# EAGLE design coil-control-rev (EAGLE 9.6.2)
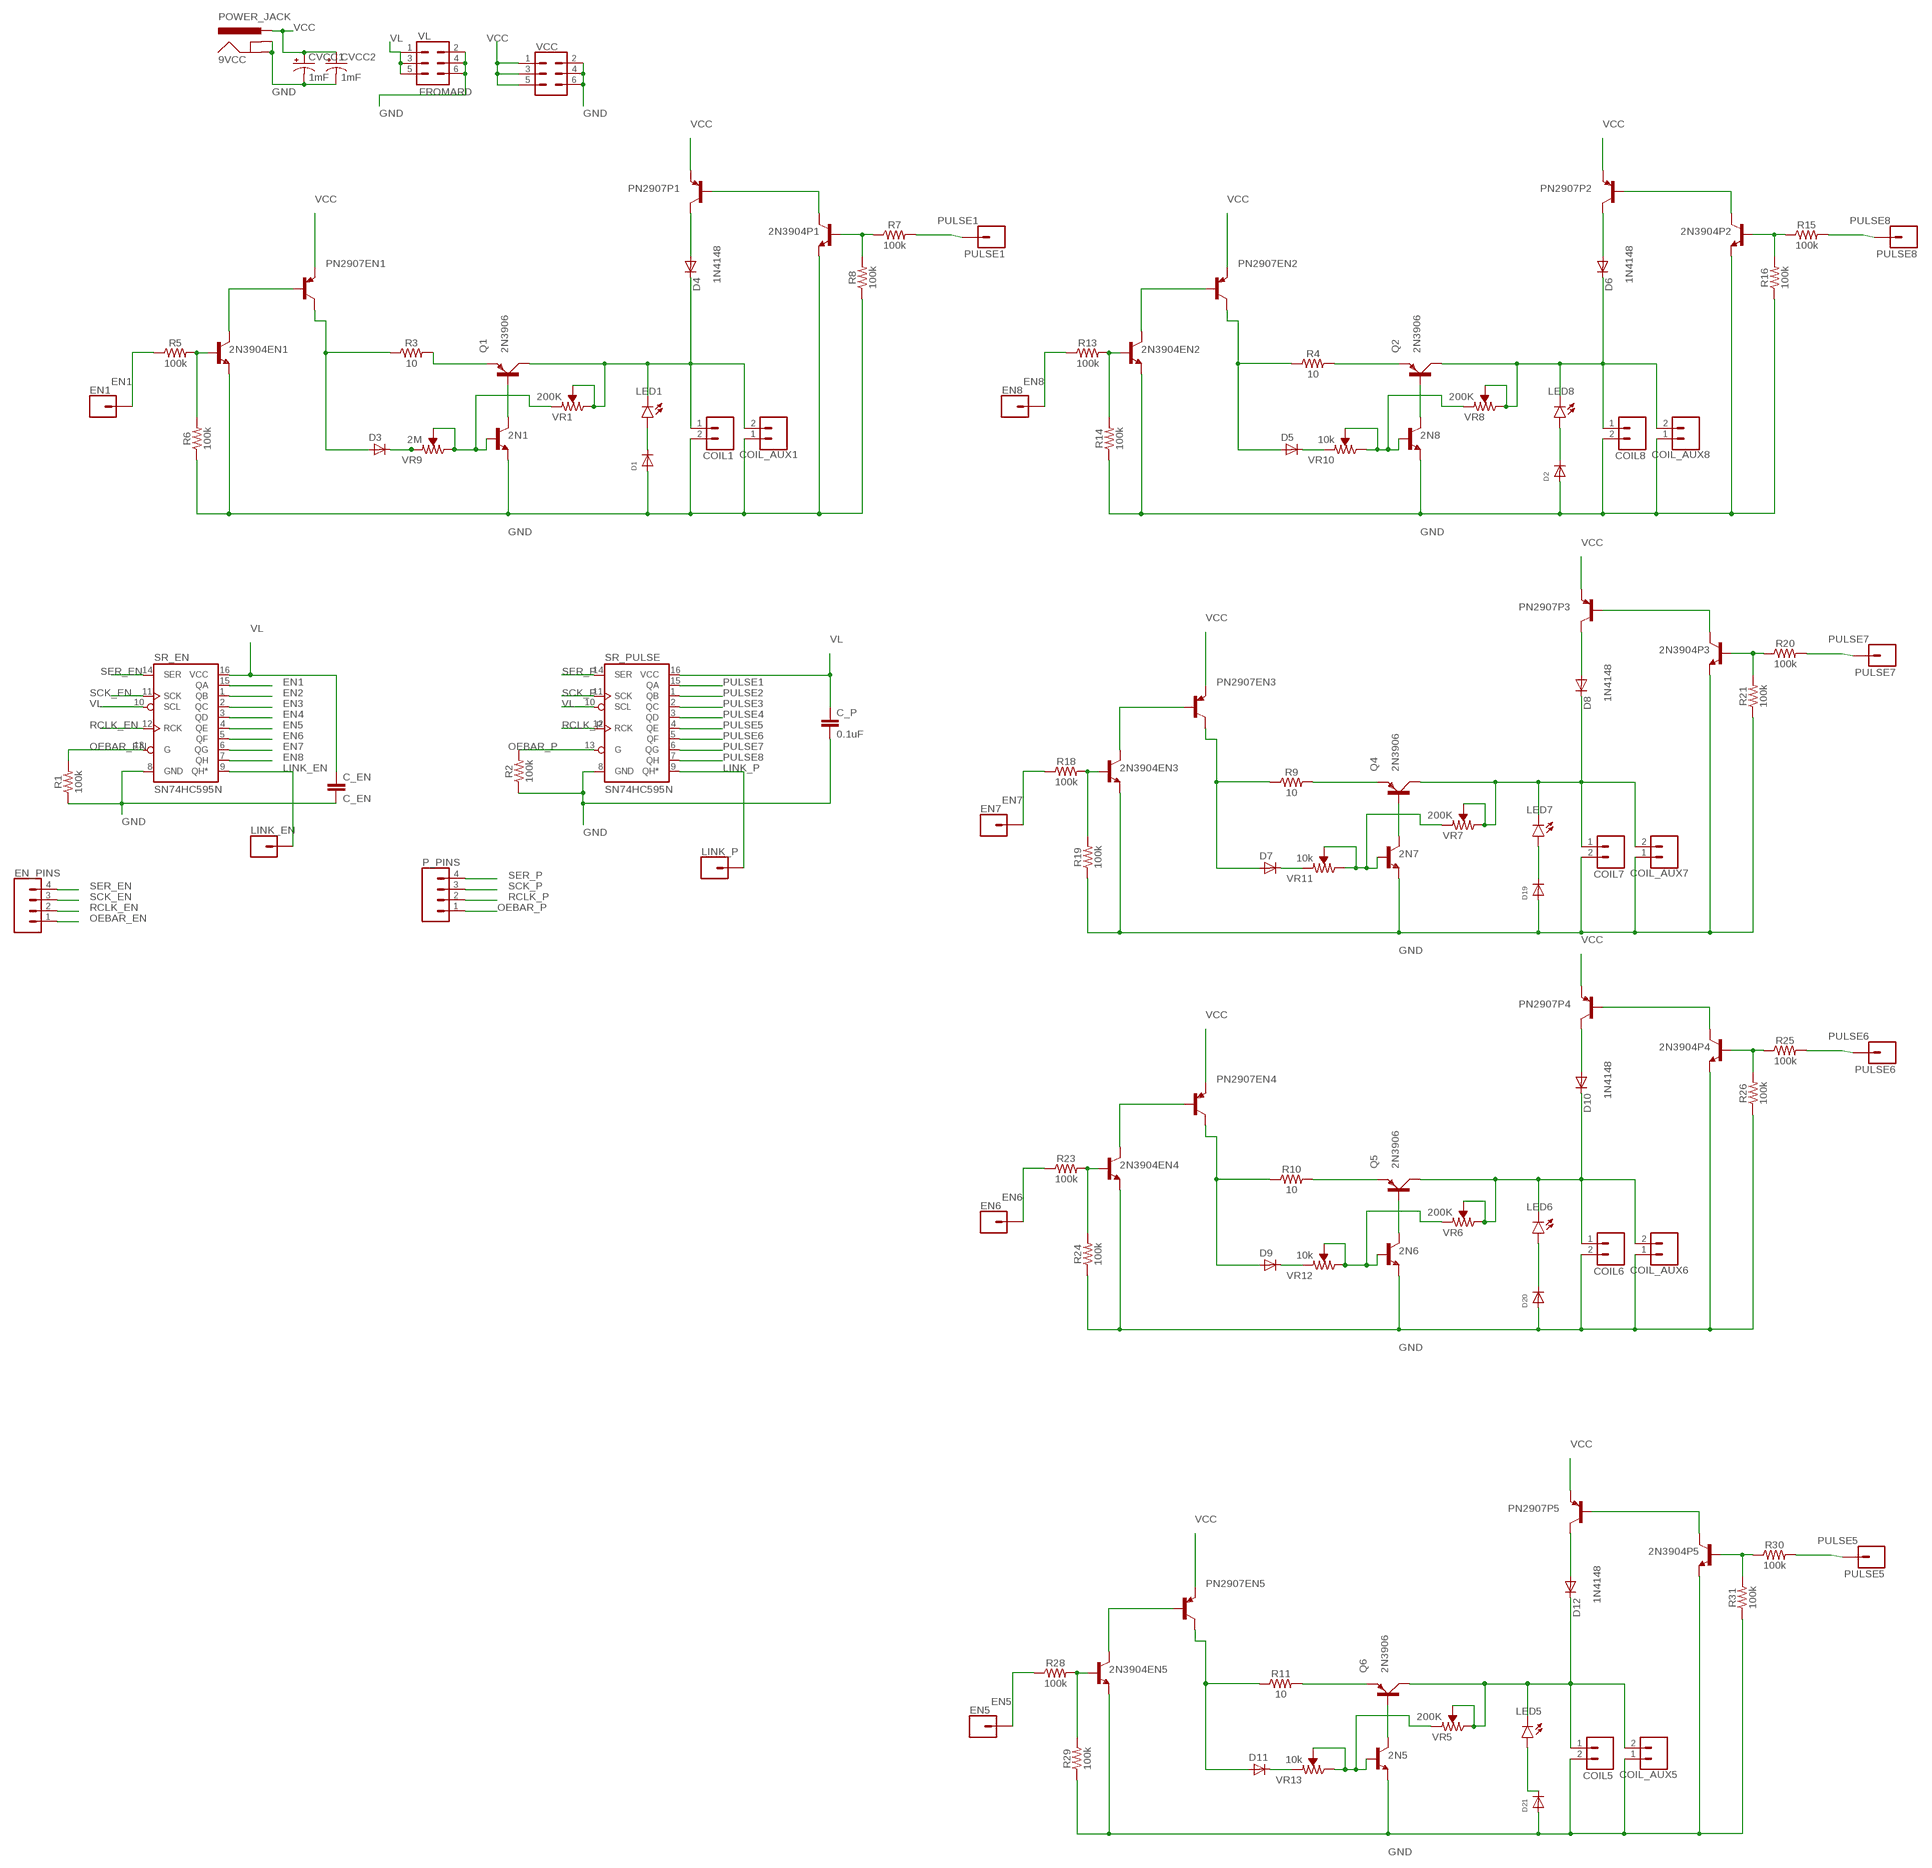
[diagram p0: schematic, sheet 1, part 1 of 2]
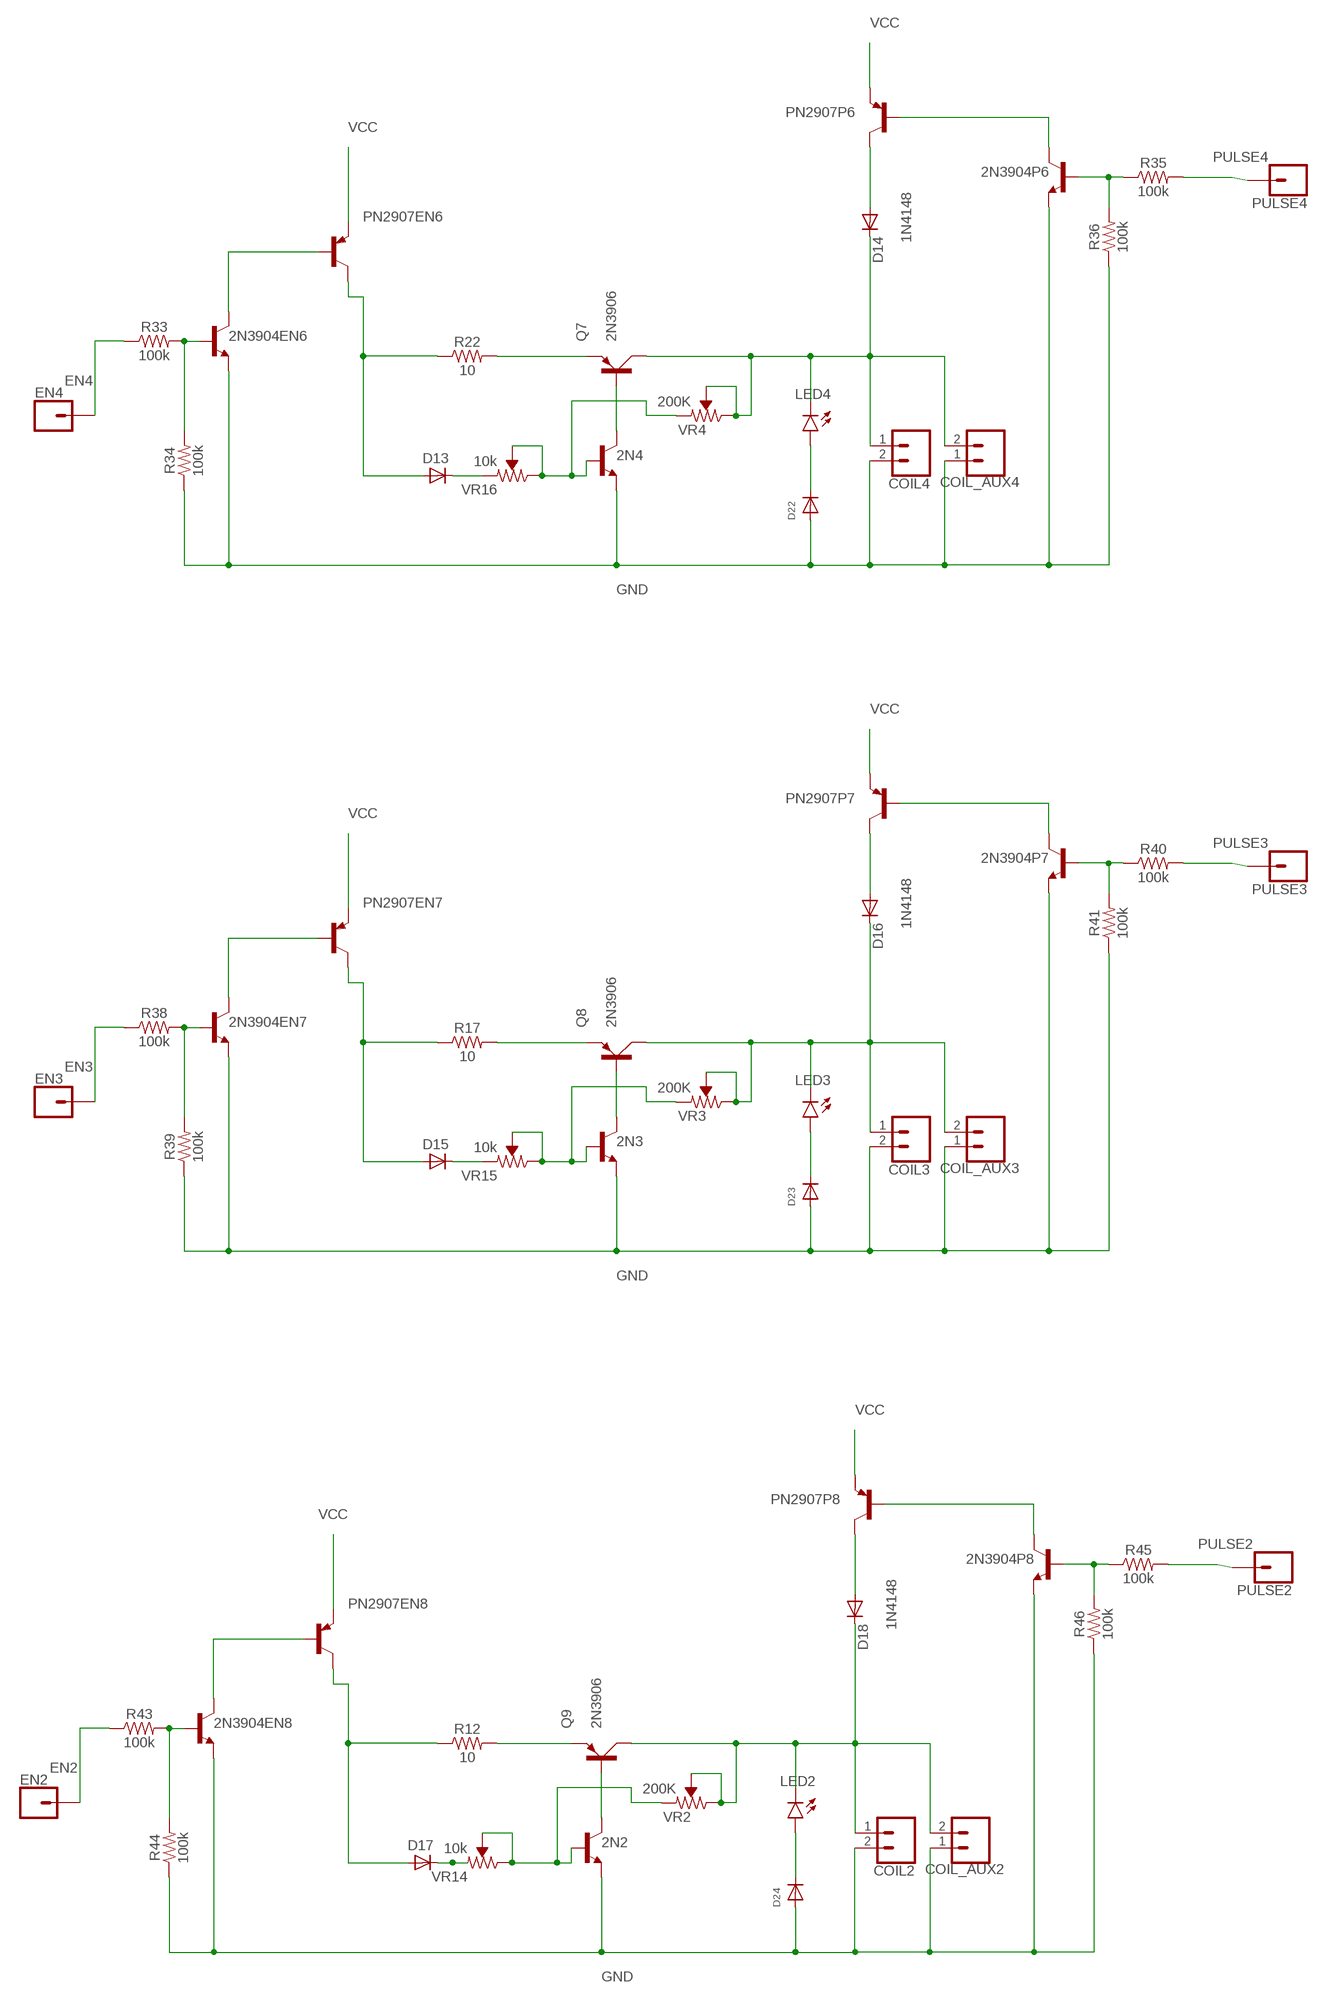
[diagram p1: schematic, sheet 1, part 2 of 2]

## Parts
2N1  2N2222  [TO92-EBC-OVAL]
2N2  2N2222  [TO92-EBC-OVAL]
2N3  2N2222  [TO92-EBC-OVAL]
2N4  2N2222  [TO92-EBC-OVAL]
2N5  2N2222  [TO92-EBC-OVAL]
2N6  2N2222  [TO92-EBC-OVAL]
2N7  2N2222  [TO92-EBC-OVAL]
2N8  2N2222  [TO92-EBC-OVAL]
2N3904EN1  2N3904  [TO92]
2N3904EN2  2N3904  [TO92]
2N3904EN3  2N3904  [TO92]
2N3904EN4  2N3904  [TO92]
2N3904EN5  2N3904  [TO92]
2N3904EN6  2N3904  [TO92]
2N3904EN7  2N3904  [TO92]
2N3904EN8  2N3904  [TO92]
2N3904P1  2N3904  [TO92]
2N3904P2  2N3904  [TO92]
2N3904P3  2N3904  [TO92]
2N3904P4  2N3904  [TO92]
2N3904P5  2N3904  [TO92]
2N3904P6  2N3904  [TO92]
2N3904P7  2N3904  [TO92]
2N3904P8  2N3904  [TO92]
9VCC  POWER_JACK  [POWER_JACK_PTH]
C_EN  C_EN  0.1UF-KIT-EZ-50V-20%  [CAP-PTH-SMALL-KIT]
C_P  0.1uF  0.1UF-KIT-EZ-50V-20%  [CAP-PTH-SMALL-KIT]
COIL1  CONN_02  [1X02]
COIL2  CONN_02  [1X02]
COIL3  CONN_02  [1X02]
COIL4  CONN_02  [1X02]
COIL5  CONN_02  [1X02]
COIL6  CONN_02  [1X02]
COIL7  CONN_02  [1X02]
COIL8  CONN_02  [1X02]
COIL_AUX1  CONN_02  [1X02]
COIL_AUX2  CONN_02  [1X02]
COIL_AUX3  CONN_02  [1X02]
COIL_AUX4  CONN_02  [1X02]
COIL_AUX5  CONN_02  [1X02]
COIL_AUX6  CONN_02  [1X02]
COIL_AUX7  CONN_02  [1X02]
COIL_AUX8  CONN_02  [1X02]
CVCC1  1mF  1000UF-RADIAL-5MM-25V-20%  [CPOL-RADIAL-5MM-10MM]
CVCC2  1mF  1000UF-RADIAL-5MM-25V-20%  [CPOL-RADIAL-5MM-10MM]
D1  DIODEDO-1N4148  [DO-1N4148]
D2  DIODEDO-1N4148  [DO-1N4148]
D3  DIODEDO-1N4148  [DO-1N4148]
D4  1N4148  DIODEDO-1N4148  [DO-1N4148]
D5  DIODEDO-1N4148  [DO-1N4148]
D6  1N4148  DIODEDO-1N4148  [DO-1N4148]
D7  DIODEDO-1N4148  [DO-1N4148]
D8  1N4148  DIODEDO-1N4148  [DO-1N4148]
D9  DIODEDO-1N4148  [DO-1N4148]
D10  1N4148  DIODEDO-1N4148  [DO-1N4148]
D11  200mA/100V/1V  DIODEDO-1N4148  [DO-1N4148]
D12  1N4148  DIODEDO-1N4148  [DO-1N4148]
D13  DIODEDO-1N4148  [DO-1N4148]
D14  1N4148  DIODEDO-1N4148  [DO-1N4148]
D15  DIODEDO-1N4148  [DO-1N4148]
D16  1N4148  DIODEDO-1N4148  [DO-1N4148]
D17  DIODEDO-1N4148  [DO-1N4148]
D18  1N4148  DIODEDO-1N4148  [DO-1N4148]
D19  DIODEDO-1N4148  [DO-1N4148]
D20  DIODEDO-1N4148  [DO-1N4148]
D21  DIODEDO-1N4148  [DO-1N4148]
D22  DIODEDO-1N4148  [DO-1N4148]
D23  DIODEDO-1N4148  [DO-1N4148]
D24  DIODEDO-1N4148  [DO-1N4148]
EN1  CONN_01  [1X01]
EN2  CONN_01  [1X01]
EN3  CONN_01  [1X01]
EN4  CONN_01  [1X01]
EN5  CONN_01  [1X01]
EN6  CONN_01  [1X01]
EN7  CONN_01  [1X01]
EN8  EN2  CONN_01  [1X01]
EN_PINS  CONN_04PTH  [1X04]
LED1  LED3MM  [LED_3MM]
LED2  LED3MM  [LED_3MM]
LED3  LED3MM  [LED_3MM]
LED4  LED3MM  [LED_3MM]
LED5  LED3MM  [LED_3MM]
LED6  LED3MM  [LED_3MM]
LED7  LED3MM  [LED_3MM]
LED8  LED3MM  [LED_3MM]
LINK_EN  CONN_01  [1X01]
LINK_P  CONN_01  [1X01]
P_PINS  CONN_04PTH  [1X04]
PN2907EN1  2N2907  [TO92-EBC-OVAL]
PN2907EN2  2N2907  [TO92-EBC-OVAL]
PN2907EN3  2N2907  [TO92-EBC-OVAL]
PN2907EN4  2N2907  [TO92-EBC-OVAL]
PN2907EN5  2N2907  [TO92-EBC-OVAL]
PN2907EN6  2N2907  [TO92-EBC-OVAL]
PN2907EN7  2N2907  [TO92-EBC-OVAL]
PN2907EN8  2N2907  [TO92-EBC-OVAL]
PN2907P1  2N2907  [TO92-EBC-OVAL]
PN2907P2  2N2907  [TO92-EBC-OVAL]
PN2907P3  2N2907  [TO92-EBC-OVAL]
PN2907P4  2N2907  [TO92-EBC-OVAL]
PN2907P5  2N2907  [TO92-EBC-OVAL]
PN2907P6  2N2907  [TO92-EBC-OVAL]
PN2907P7  2N2907  [TO92-EBC-OVAL]
PN2907P8  2N2907  [TO92-EBC-OVAL]
PULSE1  CONN_01  [1X01]
PULSE2  CONN_01  [1X01]
PULSE3  CONN_01  [1X01]
PULSE4  CONN_01  [1X01]
PULSE5  CONN_01  [1X01]
PULSE6  CONN_01  [1X01]
PULSE7  PULSE3  CONN_01  [1X01]
PULSE8  PULSE2  CONN_01  [1X01]
Q1  2N3906  [TO92D]
Q2  2N3906  [TO92D]
Q4  2N3906  [TO92D]
Q5  2N3906  [TO92D]
Q6  2N3906  [TO92D]
Q7  2N3906  [TO92D]
Q8  2N3906  [TO92D]
Q9  2N3906  [TO92D]
R1  100k  100KOHM-HORIZ-1/4W-1%  [AXIAL-0.3]
R2  100k  100KOHM-HORIZ-1/4W-1%  [AXIAL-0.3]
R3  10  10OHM-VERT-1/4W-1%  [AXIAL-0.1]
R4  10  10OHM-VERT-1/4W-1%  [AXIAL-0.1]
R5  100k  100KOHM-HORIZ-1/4W-1%  [AXIAL-0.3]
R6  100k  100KOHM-HORIZ-1/4W-1%  [AXIAL-0.3]
R7  100k  100KOHM-HORIZ-1/4W-1%  [AXIAL-0.3]
R8  100k  100KOHM-HORIZ-1/4W-1%  [AXIAL-0.3]
R9  10  10OHM-VERT-1/4W-1%  [AXIAL-0.1]
R10  10  10OHM-VERT-1/4W-1%  [AXIAL-0.1]
R11  10  10OHM-VERT-1/4W-1%  [AXIAL-0.1]
R12  10  10OHM-VERT-1/4W-1%  [AXIAL-0.1]
R13  100k  100KOHM-HORIZ-1/4W-1%  [AXIAL-0.3]
R14  100k  100KOHM-HORIZ-1/4W-1%  [AXIAL-0.3]
R15  100k  100KOHM-HORIZ-1/4W-1%  [AXIAL-0.3]
R16  100k  100KOHM-HORIZ-1/4W-1%  [AXIAL-0.3]
R17  10  10OHM-VERT-1/4W-1%  [AXIAL-0.1]
R18  100k  100KOHM-HORIZ-1/4W-1%  [AXIAL-0.3]
R19  100k  100KOHM-HORIZ-1/4W-1%  [AXIAL-0.3]
R20  100k  100KOHM-HORIZ-1/4W-1%  [AXIAL-0.3]
R21  100k  100KOHM-HORIZ-1/4W-1%  [AXIAL-0.3]
R22  10  10OHM-VERT-1/4W-1%  [AXIAL-0.1]
R23  100k  100KOHM-HORIZ-1/4W-1%  [AXIAL-0.3]
R24  100k  100KOHM-HORIZ-1/4W-1%  [AXIAL-0.3]
R25  100k  100KOHM-HORIZ-1/4W-1%  [AXIAL-0.3]
R26  100k  100KOHM-HORIZ-1/4W-1%  [AXIAL-0.3]
R28  100k  100KOHM-HORIZ-1/4W-1%  [AXIAL-0.3]
R29  100k  100KOHM-HORIZ-1/4W-1%  [AXIAL-0.3]
R30  100k  100KOHM-HORIZ-1/4W-1%  [AXIAL-0.3]
R31  100k  100KOHM-HORIZ-1/4W-1%  [AXIAL-0.3]
R33  100k  100KOHM-HORIZ-1/4W-1%  [AXIAL-0.3]
R34  100k  100KOHM-HORIZ-1/4W-1%  [AXIAL-0.3]
R35  100k  100KOHM-HORIZ-1/4W-1%  [AXIAL-0.3]
R36  100k  100KOHM-HORIZ-1/4W-1%  [AXIAL-0.3]
R38  100k  100KOHM-HORIZ-1/4W-1%  [AXIAL-0.3]
R39  100k  100KOHM-HORIZ-1/4W-1%  [AXIAL-0.3]
R40  100k  100KOHM-HORIZ-1/4W-1%  [AXIAL-0.3]
R41  100k  100KOHM-HORIZ-1/4W-1%  [AXIAL-0.3]
R43  100k  100KOHM-HORIZ-1/4W-1%  [AXIAL-0.3]
R44  100k  100KOHM-HORIZ-1/4W-1%  [AXIAL-0.3]
R45  100k  100KOHM-HORIZ-1/4W-1%  [AXIAL-0.3]
R46  100k  100KOHM-HORIZ-1/4W-1%  [AXIAL-0.3]
SR_EN  SN74HC595N  74HC595N  [DIP16]
SR_PULSE  SN74HC595N  74HC595N  [DIP16]
VCC  CONN_03X2NO_SILK  [2X3-NS]
VL  FROMARD  CONN_03X2FEMALE  [2X3]
VR1  200K  TRIMPOT-PTH-10MM-KNOB-1/2W-10%  [TRIMPOT-PTH-3386U]
VR2  200K  TRIMPOT-PTH-10MM-KNOB-1/2W-10%  [TRIMPOT-PTH-3386U]
VR3  200K  TRIMPOT-PTH-10MM-KNOB-1/2W-10%  [TRIMPOT-PTH-3386U]
VR4  200K  TRIMPOT-PTH-10MM-KNOB-1/2W-10%  [TRIMPOT-PTH-3386U]
VR5  200K  TRIMPOT-PTH-10MM-KNOB-1/2W-10%  [TRIMPOT-PTH-3386U]
VR6  200K  TRIMPOT-PTH-10MM-KNOB-1/2W-10%  [TRIMPOT-PTH-3386U]
VR7  200K  TRIMPOT-PTH-10MM-KNOB-1/2W-10%  [TRIMPOT-PTH-3386U]
VR8  200K  TRIMPOT-PTH-10MM-KNOB-1/2W-10%  [TRIMPOT-PTH-3386U]
VR9  2M  TRIMPOT-PTH-10MM-KNOB-1/2W-10%  [TRIMPOT-PTH-3386U]
VR10  10k  TRIMPOT-PTH-10MM-KNOB-1/2W-10%  [TRIMPOT-PTH-3386U]
VR11  10k  TRIMPOT-PTH-10MM-KNOB-1/2W-10%  [TRIMPOT-PTH-3386U]
VR12  10k  TRIMPOT-PTH-10MM-KNOB-1/2W-10%  [TRIMPOT-PTH-3386U]
VR13  10k  TRIMPOT-PTH-10MM-KNOB-1/2W-10%  [TRIMPOT-PTH-3386U]
VR14  10k  TRIMPOT-PTH-10MM-KNOB-1/2W-10%  [TRIMPOT-PTH-3386U]
VR15  10k  TRIMPOT-PTH-10MM-KNOB-1/2W-10%  [TRIMPOT-PTH-3386U]
VR16  10k  TRIMPOT-PTH-10MM-KNOB-1/2W-10%  [TRIMPOT-PTH-3386U]

## Nets
EN1: EN1.1 R5.P$1 SR_EN.15(QA)
EN2: EN2.1 R43.P$1 SR_EN.1(QB)
EN3: EN3.1 R38.P$1 SR_EN.2(QC)
EN4: EN4.1 R33.P$1 SR_EN.3(QD)
EN5: EN5.1 R28.P$1 SR_EN.4(QE)
EN6: EN6.1 R23.P$1 SR_EN.5(QF)
EN7: EN7.1 R18.P$1 SR_EN.6(QG)
EN8: EN8.1 R13.P$1 SR_EN.7(QH)
GND: 2N1.E 2N2.E 2N3.E 2N4.E 2N5.E 2N6.E 2N7.E 2N8.E 2N3904EN1.3(E) 2N3904EN2.3(E) 2N3904EN3.3(E) 2N3904EN4.3(E) 2N3904EN5.3(E) 2N3904EN6.3(E) 2N3904EN7.3(E) 2N3904EN8.3(E) 2N3904P1.3(E) 2N3904P2.3(E) 2N3904P3.3(E) 2N3904P4.3(E) 2N3904P5.3(E) 2N3904P6.3(E) 2N3904P7.3(E) 2N3904P8.3(E) 9VCC.GND 9VCC.GNDBREAK C_EN.2 C_P.2 COIL1.2 COIL2.2 COIL3.2 COIL4.2 COIL5.2 COIL6.2 COIL7.2 COIL8.2 COIL_AUX1.1 COIL_AUX2.1 COIL_AUX3.1 COIL_AUX4.1 COIL_AUX5.1 COIL_AUX6.1 COIL_AUX7.1 COIL_AUX8.1 CVCC1.- CVCC2.- D1.A D2.A D19.A D20.A D21.A D22.A D23.A D24.A R1.P$1 R2.P$1 R6.P$1 R8.P$1 R14.P$1 R16.P$1 R19.P$1 R21.P$1 R24.P$1 R26.P$1 R29.P$1 R31.P$1 R34.P$1 R36.P$1 R39.P$1 R41.P$1 R44.P$1 R46.P$1 SR_EN.8(GND) SR_PULSE.8(GND) VCC.2 VCC.4 VCC.6 VL.2 VL.4 VL.6
LINK_EN: LINK_EN.1 SR_EN.9(QH*)
LINK_P: LINK_P.1 SR_PULSE.9(QH*)
N$1: 2N3904EN2.1(C) PN2907EN2.B
N$2: 2N3904EN3.1(C) PN2907EN3.B
N$3: 2N3904EN1.1(C) PN2907EN1.B
N$4: 2N3904EN4.1(C) PN2907EN4.B
N$5: 2N3904EN5.1(C) PN2907EN5.B
N$6: 2N3904EN8.1(C) PN2907EN8.B
N$7: 2N1.B VR1.1(CCW) VR9.2(WIPER) VR9.3(CW)
N$8: 2N3904EN7.1(C) PN2907EN7.B
N$9: D3.C VR9.1(CCW)
N$10: 2N1.C Q1.B
N$11: D4.A PN2907P1.C
N$12: D3.A PN2907EN1.C R3.P$1
N$13: 2N3904P1.2(B) R7.P$1 R8.P$2
N$14: 2N3904P1.1(C) PN2907P1.B
N$15: 2N3904EN1.2(B) R5.P$2 R6.P$2
N$16: 2N8.B VR8.1(CCW) VR10.2(WIPER) VR10.3(CW)
N$17: 2N3904EN6.1(C) PN2907EN6.B
N$18: D5.C VR10.1(CCW)
N$19: 2N8.C Q2.B
N$20: D6.A PN2907P2.C
N$21: D5.A PN2907EN2.C R4.P$1
N$22: 2N3904P2.2(B) R15.P$1 R16.P$2
N$23: 2N3904P2.1(C) PN2907P2.B
N$24: 2N3904EN2.2(B) R13.P$2 R14.P$2
N$25: D9.C VR12.1(CCW)
N$26: D7.C VR11.1(CCW)
N$27: 2N7.C Q4.B
N$28: D8.A PN2907P3.C
N$29: D7.A PN2907EN3.C R9.P$1
N$30: 2N3904P3.2(B) R20.P$1 R21.P$2
N$31: 2N3904P3.1(C) PN2907P3.B
N$32: 2N3904EN3.2(B) R18.P$2 R19.P$2
N$33: 2N6.B VR6.1(CCW) VR12.2(WIPER) VR12.3(CW)
N$34: Q1.E R3.P$2
N$35: 2N6.C Q5.B
N$36: D10.A PN2907P4.C
N$37: D9.A PN2907EN4.C R10.P$1
N$38: 2N3904P4.2(B) R25.P$1 R26.P$2
N$39: 2N3904P4.1(C) PN2907P4.B
N$40: 2N3904EN4.2(B) R23.P$2 R24.P$2
N$41: 2N5.B VR5.1(CCW) VR13.2(WIPER) VR13.3(CW)
N$42: D11.C VR13.1(CCW)
N$43: 2N5.C Q6.B
N$44: D12.A PN2907P5.C
N$45: D11.A PN2907EN5.C R11.P$1
N$46: 2N3904P5.2(B) R30.P$1 R31.P$2
N$47: 2N3904P5.1(C) PN2907P5.B
N$48: 2N3904EN5.2(B) R28.P$2 R29.P$2
N$49: Q2.E R4.P$2
N$50: D13.C VR16.1(CCW)
N$51: 2N4.C Q7.B
N$52: D14.A PN2907P6.C
N$53: D13.A PN2907EN6.C R22.P$1
N$54: 2N3904P6.2(B) R35.P$1 R36.P$2
N$55: 2N3904P6.1(C) PN2907P6.B
N$56: 2N3904EN6.2(B) R33.P$2 R34.P$2
N$57: Q4.E R9.P$2
N$58: D15.C VR15.1(CCW)
N$59: 2N3.C Q8.B
N$60: D16.A PN2907P7.C
N$61: D15.A PN2907EN7.C R17.P$1
N$62: 2N3904P7.2(B) R40.P$1 R41.P$2
N$63: 2N3904P7.1(C) PN2907P7.B
N$64: 2N3904EN7.2(B) R38.P$2 R39.P$2
N$65: Q5.E R10.P$2
N$66: D17.C VR14.1(CCW)
N$67: 2N2.C Q9.B
N$68: D18.A PN2907P8.C
N$69: D17.A PN2907EN8.C R12.P$1
N$70: 2N3904P8.2(B) R45.P$1 R46.P$2
N$71: 2N3904P8.1(C) PN2907P8.B
N$72: 2N3904EN8.2(B) R43.P$2 R44.P$2
N$73: 2N3.B VR3.1(CCW) VR15.2(WIPER) VR15.3(CW)
N$74: 2N7.B VR7.1(CCW) VR11.2(WIPER) VR11.3(CW)
N$75: 2N2.B VR2.1(CCW) VR14.2(WIPER) VR14.3(CW)
N$76: 2N4.B VR4.1(CCW) VR16.2(WIPER) VR16.3(CW)
N$77: Q6.E R11.P$2
N$78: Q9.E R12.P$2
N$79: Q8.E R17.P$2
N$80: Q7.E R22.P$2
N$81: D1.C LED1.A
N$82: D2.C LED8.A
N$83: D19.C LED7.A
N$84: D20.C LED6.A
N$85: D21.C LED5.A
N$86: D24.C LED2.A
N$87: D23.C LED3.A
N$88: D22.C LED4.A
OEBAR_EN: EN_PINS.1 R1.P$2 SR_EN.13(G)
OEBAR_P: P_PINS.1 R2.P$2 SR_PULSE.13(G)
PULSE1: PULSE1.1 R7.P$2 SR_PULSE.15(QA)
PULSE2: PULSE2.1 R45.P$2 SR_PULSE.1(QB)
PULSE3: PULSE3.1 R40.P$2 SR_PULSE.2(QC)
PULSE4: PULSE4.1 R35.P$2 SR_PULSE.3(QD)
PULSE5: PULSE5.1 R30.P$2 SR_PULSE.4(QE)
PULSE6: PULSE6.1 R25.P$2 SR_PULSE.5(QF)
PULSE7: PULSE7.1 R20.P$2 SR_PULSE.6(QG)
PULSE8: PULSE8.1 R15.P$2 SR_PULSE.7(QH)
RCLK_EN: EN_PINS.2 SR_EN.12(RCK)
RCLK_P: P_PINS.2 SR_PULSE.12(RCK)
S2: COIL1.1 COIL_AUX1.2 D4.C LED1.K(C) Q1.C VR1.2(WIPER) VR1.3(CW)
S3: COIL8.1 COIL_AUX8.2 D6.C LED8.K(C) Q2.C VR8.2(WIPER) VR8.3(CW)
S4: COIL7.1 COIL_AUX7.2 D8.C LED7.K(C) Q4.C VR7.2(WIPER) VR7.3(CW)
S5: COIL6.1 COIL_AUX6.2 D10.C LED6.K(C) Q5.C VR6.2(WIPER) VR6.3(CW)
S6: COIL5.1 COIL_AUX5.2 D12.C LED5.K(C) Q6.C VR5.2(WIPER) VR5.3(CW)
S7: COIL4.1 COIL_AUX4.2 D14.C LED4.K(C) Q7.C VR4.2(WIPER) VR4.3(CW)
S8: COIL3.1 COIL_AUX3.2 D16.C LED3.K(C) Q8.C VR3.2(WIPER) VR3.3(CW)
S9: COIL2.1 COIL_AUX2.2 D18.C LED2.K(C) Q9.C VR2.2(WIPER) VR2.3(CW)
SCK_EN: EN_PINS.3 SR_EN.11(SCK)
SCK_P: P_PINS.3 SR_PULSE.11(SCK)
SER_EN: EN_PINS.4 SR_EN.14(SER)
SER_P: P_PINS.4 SR_PULSE.14(SER)
VCC: 9VCC.PWR CVCC1.+ CVCC2.+ PN2907EN1.E PN2907EN2.E PN2907EN3.E PN2907EN4.E PN2907EN5.E PN2907EN6.E PN2907EN7.E PN2907EN8.E PN2907P1.E PN2907P2.E PN2907P3.E PN2907P4.E PN2907P5.E PN2907P6.E PN2907P7.E PN2907P8.E VCC.1 VCC.3 VCC.5
VL: C_EN.1 C_P.1 SR_EN.10(SCL) SR_EN.16(VCC) SR_PULSE.10(SCL) SR_PULSE.16(VCC) VL.1 VL.3 VL.5

## Library data of the parts
2N1-2N8 = adafruit:2N2222: NPN TRANSISTOR Big oval pads
2N3904EN1-2N3904EN8 2N3904P1-2N3904P8 = transistor:2N3904: NPN TRANSISTOR
9VCC = SparkFun-Connectors:POWER_JACK: Power Jack Connector This is the standard 5.5mm barrel jack for power. The PTH is the most common, proven, reliable, footprint. The Slot footprint only works if the mill layer is transmitted to the PCB fab house so be warned. Here are the connectors we sell at SparkFun: DC Barrel Power Jack/Connector <https://www.sparkfun.com/products/119> (PRT-00119) DC Barrel Power Jack/Connector (SMD) <https://www.sparkfun.com/products/12748> (PRT-12748) DC Barrel Jack Adapter - Breadboard Compatible <https://www.sparkfun.com/products/10811> (PRT-10811) It is used on this SparkFun product (and many, many others): SparkFun RedBoard - Programmed with Arduino <https://www.sparkfun.com/products/12757> (DEV-12757) Also, if you need a mating power supply or connector, please check these out: Wall Adapter Power Supply - 9VDC 650mA <https://www.sparkfun.com/products/298> (TOL-00298) DC Barrel Jack Adapter - Male <https://www.sparkfun.com/products/10287> (PRT-10287); PROD_ID: CONN-08197
C_EN = SparkFun-Capacitors:0.1UF: 0.1µF ceramic capacitors A capacitor is a passive two-terminal electrical component used to store electrical energy temporarily in an electric field.; PROD_ID: CAP-08370; VALUE: 0.1uF
C_P = SparkFun-Capacitors:0.1UF: 0.1µF ceramic capacitors A capacitor is a passive two-terminal electrical component used to store electrical energy temporarily in an electric field.; PROD_ID: CAP-08370
COIL1-COIL8 COIL_AUX1-COIL_AUX8 = SparkFun-Connectors:CONN_02: Multi connection point. Often used as Generic Header-pin footprint for 0.1 inch spaced/style header connections On any of the 0.1 inch spaced packages, you can populate with these: Break Away Headers - Straight <https://www.sparkfun.com/products/116> (PRT-00116) Break Away Male Headers - Right Angle <https://www.sparkfun.com/products/553> (PRT-00553) Female Headers <https://www.sparkfun.com/products/115> (PRT-00115) Break Away Headers - Machine Pin <https://www.sparkfun.com/products/117> (PRT-00117) Break Away Female Headers - Swiss Machine Pin <https://www.sparkfun.com/products/743> (PRT-00743) For SCREWTERMINALS and SPRING TERMINALS visit here: Screw Terimnals on SparkFun.com <https://www.sparkfun.com/search/results?term=Screw+Terminals> (5mm/3.5mm/2.54mm spacing) This device is also useful as a general connection point to wire up your design to another part of your project. Our various solder wires solder well into these plated through hole pads. Hook-Up Wire - Assortment (Stranded, 22 AWG) <https://www.sparkfun.com/products/11375> (PRT-11375) Hook-Up Wire - Assortment (Solid Core, 22 AWG) <https://www.sparkfun.com/products/11367> (PRT-11367) View the entire wire category on our website here <https://www.sparkfun.com/categories/141> Special notes: Molex polarized connector foot print use with: PRT-08233 with associated crimp pins and housings. 2.54_SCREWTERM for use with PRT-10571. 3.5mm Screw Terminal footprints for PRT-08084 5mm Screw Terminal footprints for use with PRT-08432
CVCC1 CVCC2 = SparkFun-Capacitors:1000UF: 1,000µF/1mF ceramic capacitors A capacitor is a passive two-terminal electrical component used to store electrical energy temporarily in an electric field. CAP-08070; PROD_ID: CAP-09538
D1-D24 = adafruit:DIODE: Diode SMADIODE - SMA Surface Mount Package 20V 1A Schottky Diode Digikey: 641-1014-6-ND DO-1N4148 - Through Hole Small Current Diode SOD-123 20V 1 A (.5mV Vf) Schottky Diode - Digikey: MBRX120TPMSCT-ND SOD-323 10V 570mA (.38mV Vf, 3ns) Schottky Diode - Digikey: ZLLS410CT-ND SOD-523 30V 30mA Schottky Diode (RB751S-40TE61) - Digikey: RB751S-40TE61CT-ND SOT23-R/W - SOT23 Package (R = Solder Paste/Reflow Ovens, W = Hand-Soldering) BAT54Film 40V 300mA - Digikey: 497-7162-1-ND
EN1-EN8 LINK_EN LINK_P PULSE1-PULSE8 = SparkFun-Connectors:CONN_01: Single connection point. Often used as Generic Header-pin footprint for 0.1 inch spaced/style header connections On any of the 0.1 inch spaced packages, you can populate with these: Break Away Headers - Straight <https://www.sparkfun.com/products/116> (PRT-00116) Break Away Male Headers - Right Angle <https://www.sparkfun.com/products/553> (PRT-00553) Female Headers <https://www.sparkfun.com/products/115> (PRT-00115) Break Away Headers - Machine Pin <https://www.sparkfun.com/products/117> (PRT-00117) Break Away Female Headers - Swiss Machine Pin <https://www.sparkfun.com/products/743> (PRT-00743) This device is also useful as a general connection point to wire up your design to another part of your project. Our various solder wires solder well into these plated through hole pads. Hook-Up Wire - Assortment (Stranded, 22 AWG) <https://www.sparkfun.com/products/11375> (PRT-11375) Hook-Up Wire - Assortment (Solid Core, 22 AWG) <https://www.sparkfun.com/products/11367> (PRT-11367) View the entire wire category on our website here <https://www.sparkfun.com/categories/141> Special notes: SMTSO-256-ET is a "flush mount" nut for a 4-40 screw. We mostly use this on specialty testbeds; it is a nice way to connect hardware to your PCB at an adjustable hieght. Also note, the SNAP packages are for using a snappable style connector. We sell a baggie of snaps and they are also used on two LilyPad designs: Snap Assortment - 30 pack (male and female) <https://www.sparkfun.com/products/11347> (DEV-11347) LilyPad Arduino SimpleSnap <https://www.sparkfun.com/products/10941> (DEV-10941) LilyPad SimpleSnap Protoboard <https://www.sparkfun.com/products/10940> (DEV-10940)
EN_PINS P_PINS = SparkFun-Connectors:CONN_04: Multi connection point. Often used as Generic Header-pin footprint for 0.1 inch spaced/style header connections On any of the 0.1 inch spaced packages, you can populate with these: Break Away Headers - Straight <https://www.sparkfun.com/products/116> (PRT-00116) Break Away Male Headers - Right Angle <https://www.sparkfun.com/products/553> (PRT-00553) Female Headers <https://www.sparkfun.com/products/115> (PRT-00115) Break Away Headers - Machine Pin <https://www.sparkfun.com/products/117> (PRT-00117) Break Away Female Headers - Swiss Machine Pin <https://www.sparkfun.com/products/743> (PRT-00743) For SCREWTERMINALS and SPRING TERMINALS visit here: Screw Terimnals on SparkFun.com <https://www.sparkfun.com/search/results?term=Screw+Terminals> (5mm/3.5mm/2.54mm spacing) This device is also useful as a general connection point to wire up your design to another part of your project. Our various solder wires solder well into these plated through hole pads. Hook-Up Wire - Assortment (Stranded, 22 AWG) <https://www.sparkfun.com/products/11375> (PRT-11375) Hook-Up Wire - Assortment (Solid Core, 22 AWG) <https://www.sparkfun.com/products/11367> (PRT-11367) View the entire wire category on our website here <https://www.sparkfun.com/categories/141> Special notes: Molex polarized connector foot print use with SKU : PRT-08231 with associated crimp pins and housings. 1MM SMD Version SKU: PRT-10208; PROD_ID: CONN-09696
LED1-LED8 = SparkFun-LED:LED: LED (Generic) Standard schematic elements and footprints for 5mm, 3mm, 1206, and 0603 sized LEDs. Generic LEDs with no color specified.; PROD_ID: DIO-08794
PN2907EN1-PN2907EN8 PN2907P1-PN2907P8 = adafruit:2N2907*: PNP Transistor Big Oval pads
Q1 Q2 Q4-Q9 = transistor-small-signal:2N3906: PNP TRANSISTOR
R1 R2 R5-R8 R13-R16 R18-R21 R23-R26 R28-R31 R33-R36 R38-R41 R43-R46 = SparkFun-Resistors:100KOHM: 100kΩ resistor A resistor is a passive two-terminal electrical component that implements electrical resistance as a circuit element. Resistors act to reduce current flow, and, at the same time, act to lower voltage levels within circuits. - Wikipedia; PROD_ID: RES-12184
R3 R4 R9-R12 R17 R22 = SparkFun-Resistors:10OHM: 10Ω resistor A resistor is a passive two-terminal electrical component that implements electrical resistance as a circuit element. Resistors act to reduce current flow, and, at the same time, act to lower voltage levels within circuits. - Wikipedia; PROD_ID: RES-12180
SR_EN SR_PULSE = SparkFun-IC-Logic:74*595: 8-Bit Shift Register (Serial to Parallel) Datasheet <http://cdn.sparkfun.com/datasheets/BreakoutBoards/MM74HC595.pdf> SparkFun Products SparkFun Shift Register Breakout - 74HC595 <https://www.sparkfun.com/products/10680> (BOB-10680); PROD_ID: IC-13123
VCC = SparkFun-Connectors:CONN_03X2: Multi connection point. Often used as Generic Header-pin footprint for 0.1 inch spaced/style header connections You can populate with any combo of single row headers, but if you'd like an exact match, check these: Header - 2x3 (Male, 0.1") <https://www.sparkfun.com/products/12807> (PRT-12807) Header - 2x3 (Female, 0.1") <https://www.sparkfun.com/products/13010> (PRT-13010) 2x3 Pin Shrouded Header <https://www.sparkfun.com/products/10877> (PRT-10877) On any of the 0.1 inch spaced packages, you can populate with these: Break Away Headers - Straight <https://www.sparkfun.com/products/116> (PRT-00116) Break Away Male Headers - Right Angle <https://www.sparkfun.com/products/553> (PRT-00553) Female Headers <https://www.sparkfun.com/products/115> (PRT-00115) Break Away Headers - Machine Pin <https://www.sparkfun.com/products/117> (PRT-00117) Break Away Female Headers - Swiss Machine Pin <https://www.sparkfun.com/products/743> (PRT-00743) Special note: the shrouded connector mates well with our 3x2 ribbon cables: Ribbon Crimp Connector - 6-pin (2x3, Female) <https://www.sparkfun.com/products/10651> (PRT-10651) Ribbon Cable - 6 wire (15ft) <https://www.sparkfun.com/products/10646> (PRT-10646)
VL = SparkFun-Connectors:CONN_03X2: Multi connection point. Often used as Generic Header-pin footprint for 0.1 inch spaced/style header connections You can populate with any combo of single row headers, but if you'd like an exact match, check these: Header - 2x3 (Male, 0.1") <https://www.sparkfun.com/products/12807> (PRT-12807) Header - 2x3 (Female, 0.1") <https://www.sparkfun.com/products/13010> (PRT-13010) 2x3 Pin Shrouded Header <https://www.sparkfun.com/products/10877> (PRT-10877) On any of the 0.1 inch spaced packages, you can populate with these: Break Away Headers - Straight <https://www.sparkfun.com/products/116> (PRT-00116) Break Away Male Headers - Right Angle <https://www.sparkfun.com/products/553> (PRT-00553) Female Headers <https://www.sparkfun.com/products/115> (PRT-00115) Break Away Headers - Machine Pin <https://www.sparkfun.com/products/117> (PRT-00117) Break Away Female Headers - Swiss Machine Pin <https://www.sparkfun.com/products/743> (PRT-00743) Special note: the shrouded connector mates well with our 3x2 ribbon cables: Ribbon Crimp Connector - 6-pin (2x3, Female) <https://www.sparkfun.com/products/10651> (PRT-10651) Ribbon Cable - 6 wire (15ft) <https://www.sparkfun.com/products/10646> (PRT-10646); PROD_ID: CONN-11566; VALUE: FEMALE 2x3
VR1-VR9 = SparkFun-Resistors:TRIMPOT: Trimming Potentiometer (Trimpot) Three-terminal potentiometers, with an adjustable wiper and two adjustable resistors. A pot can be used to create a configurable voltage divider, or as a variable resistor. "Trimpots" are a subset of potentiometers, usually intended for "set-and-forget" applications. They're often more delicate than standard potentiometers - rated for fewer turns. Variants PTH-KNOB - PTH Trimpot w/ finger-adjustable knob Trimpot 10K with Knob <https://www.sparkfun.com/products/9806> (COM-09806) Datasheet <http://www.sparkfun.com/datasheets/Components/General/TSR-3386.pdf> SMD-3MM-CLOSED-FRAME - SMD 3mm Square Closed-Frame Trimpot Used on e.g. EasyDriver - Stepper Motor Driver <https://www.sparkfun.com/products/12779> Datasheet <http://www.bitechnologies.com/pdfs/22.pdf> (22AR10KTR) SMD-5MM - SMD 5mm Square Closed-Frame Trimpot Used on e.g. IOIO-OTG - V2.2 <https://www.sparkfun.com/products/13613> Datasheet <http://www.vishay.com/docs/51008/ts53.pdf> (TS53YL502MR10) SMD-3MM-1/10W-25% - 3mm Square Open-Frame Trimpot Used on e.g. SparkFun Shapeoko <https://www.sparkfun.com/products/13899> Datasheet <http://www.bourns.com/docs/Product-Datasheets/TC33.pdf> (TC33X-2-103E); PROD_ID: RES-09730; SF_SKU: COM-09806; VALUE: 10k
VR10-VR16 = SparkFun-Resistors:TRIMPOT: Trimming Potentiometer (Trimpot) Three-terminal potentiometers, with an adjustable wiper and two adjustable resistors. A pot can be used to create a configurable voltage divider, or as a variable resistor. "Trimpots" are a subset of potentiometers, usually intended for "set-and-forget" applications. They're often more delicate than standard potentiometers - rated for fewer turns. Variants PTH-KNOB - PTH Trimpot w/ finger-adjustable knob Trimpot 10K with Knob <https://www.sparkfun.com/products/9806> (COM-09806) Datasheet <http://www.sparkfun.com/datasheets/Components/General/TSR-3386.pdf> SMD-3MM-CLOSED-FRAME - SMD 3mm Square Closed-Frame Trimpot Used on e.g. EasyDriver - Stepper Motor Driver <https://www.sparkfun.com/products/12779> Datasheet <http://www.bitechnologies.com/pdfs/22.pdf> (22AR10KTR) SMD-5MM - SMD 5mm Square Closed-Frame Trimpot Used on e.g. IOIO-OTG - V2.2 <https://www.sparkfun.com/products/13613> Datasheet <http://www.vishay.com/docs/51008/ts53.pdf> (TS53YL502MR10) SMD-3MM-1/10W-25% - 3mm Square Open-Frame Trimpot Used on e.g. SparkFun Shapeoko <https://www.sparkfun.com/products/13899> Datasheet <http://www.bourns.com/docs/Product-Datasheets/TC33.pdf> (TC33X-2-103E); PROD_ID: RES-09730; SF_SKU: COM-09806

## Board
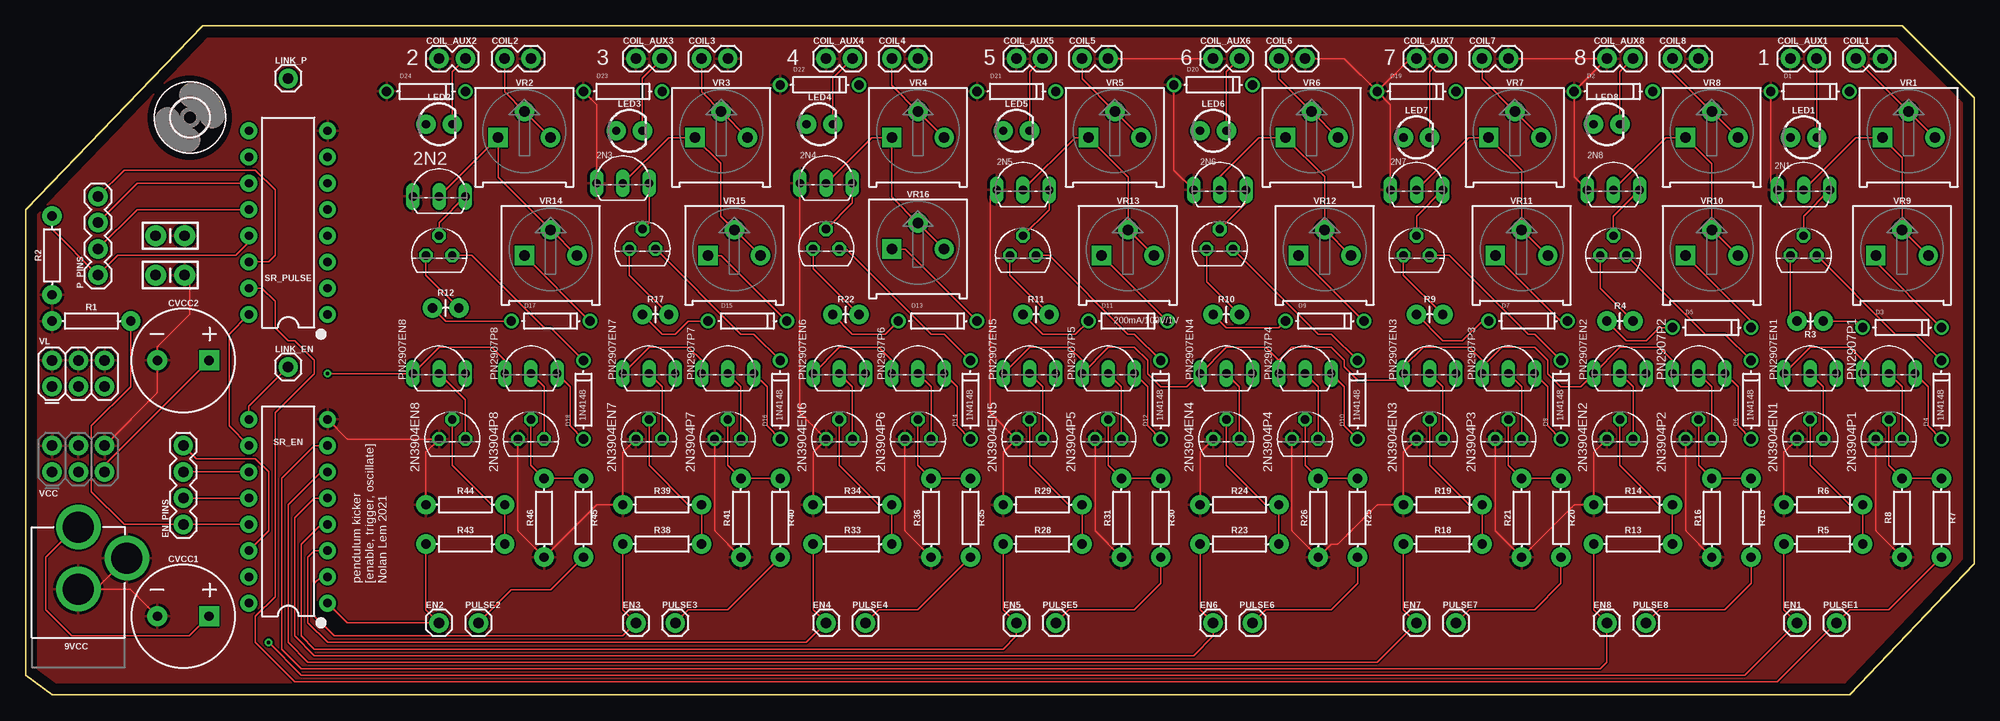
[diagram p2: board, top side]
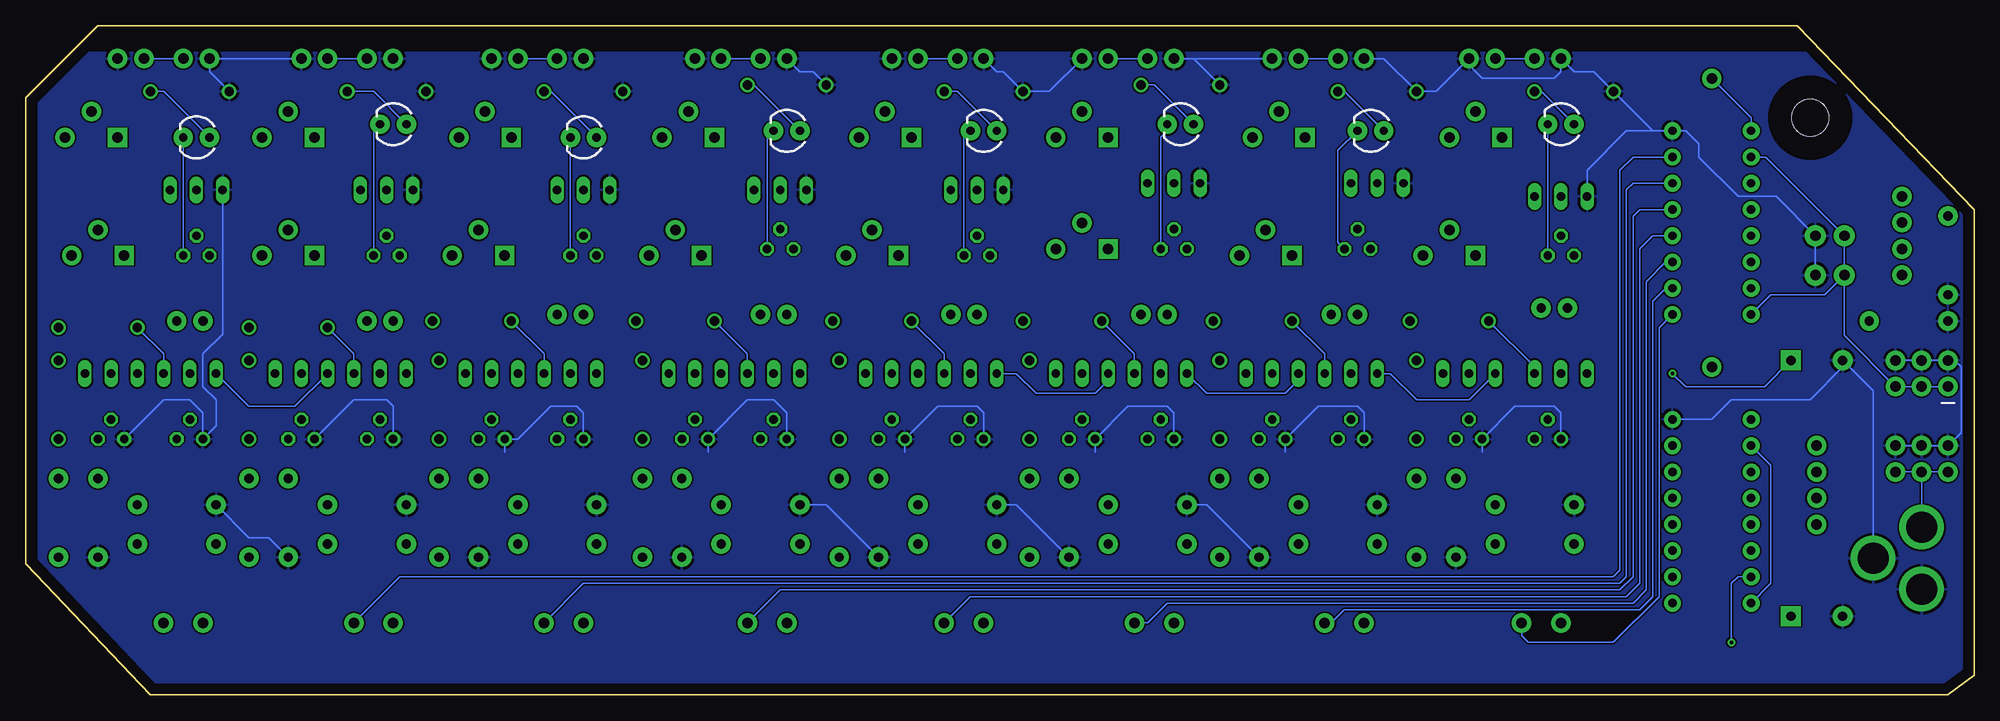
[diagram p3: board, bottom side, seen from below]

Size 188.59 x 64.77 mm. Coordinates in mm from the lower left corner, seen from the top.
Outline: 0,46.99 17.14,64.77 181.61,64.77 188.59,57.78 188.59,12.7 176.53,0 2.54,0 0,1.91 0,46.99
Copper layers (1*16): Top 0.035mm / dielectric 1.5mm / Bottom 0.035mm
Design rules "default": minimum track width 6mil, minimum drill 0.35mm, track to track 6mil, track to pad 6mil, pad to pad 6mil, via to via 6mil, smd to smd 6mil, copper to edge 40mil, drill to drill 6mil, minimum pad ring 10mil, minimum via ring 8mil, stop-mask expansion 4mil, vias tented up to drill 0mil, thermal gap 10mil

### Footprints (pad centres in the part's own frame; a part is rotated, then mirrored left to right if it is on the bottom)
TO92-EBC-OVAL = drill 0.813 long: B 0,-1.27; C 2.54,-1.27; E -2.54,-1.27
TO92 = drill 0.813 octagon: 1 1.27,0; 2 0,1.905; 3 -1.27,0
POWER_JACK_PTH = drill 2.997 pad 4.318: GND 0,7.7; GNDBREAK 4.7,10.7; PWR 0,13.7
CAP-PTH-SMALL-KIT = drill 1.016 pad 2.032: 1 -1.397,0; 2 1.397,0
1X02 = drill 1.016 pad 1.88: 1 0,0; 2 2.54,0
CPOL-RADIAL-5MM-10MM = drill 0.9 pad 1.93 square: + 2.5,0 | drill 0.9 pad 1.93: - -2.5,0
DO-1N4148 = drill 0.9: A -3.81,0; C 3.81,0
1X01 = drill 1.016 pad 1.88: 1 0,0
1X04 = drill 1.016 pad 1.88: 1 0,0; 2 2.54,0; 3 5.08,0; 4 7.62,0
LED_3MM = drill 0.813 pad 1.88: A -1.27,0; K 1.27,0
TO92D = drill 0.813 octagon: B 0,1.905; C 1.27,0; E -1.27,0
AXIAL-0.3 = drill 0.9 pad 1.88: P$1 -3.81,0; P$2 3.81,0
AXIAL-0.1 = drill 0.9 pad 1.88: P$1 -1.27,0; P$2 1.27,0
DIP16 = drill 0.813 pad 1.626: 1 -8.89,-3.81; 2 -6.35,-3.81; 3 -3.81,-3.81; 4 -1.27,-3.81; 5 1.27,-3.81; 6 3.81,-3.81; 7 6.35,-3.81; 8 8.89,-3.81; 9 8.89,3.81; 10 6.35,3.81; 11 3.81,3.81; 12 1.27,3.81; 13 -1.27,3.81; 14 -3.81,3.81; 15 -6.35,3.81; 16 -8.89,3.81
3,6 = hole 3.6: 0,0
2X3-NS = drill 1.016 pad 1.88: 1 -2.54,-1.27; 2 -2.54,1.27; 3 0,-1.27; 4 0,1.27; 5 2.54,-1.27; 6 2.54,1.27
2X3 = drill 1.016 pad 1.88: 1 0,0; 2 0,2.54; 3 2.54,0; 4 2.54,2.54; 5 5.08,0; 6 5.08,2.54
TRIMPOT-PTH-3386U = drill 1.016 pad 1.88 square: 1 -2.54,-0.015 | drill 1.016 pad 1.88: 2 0,2.485; 3 2.54,-0.015

### Placement (x,y rotation side)
2N1  172.09,50.16 0 top
2N2  40.01,49.53 0 top
2N3  57.78,50.8 0 top
2N4  77.47,50.8 0 top
2N5  96.52,50.16 0 top
2N6  115.57,50.16 0 top
2N7  134.62,50.16 0 top
2N8  153.67,50.16 0 top
2N3904EN1  172.72,24.77 0 top
2N3904EN2  154.31,24.77 0 top
2N3904EN3  135.89,24.77 0 top
2N3904EN4  116.2,24.77 0 top
2N3904EN5  97.16,24.77 0 top
2N3904EN6  78.74,24.77 0 top
2N3904EN7  60.33,24.77 0 top
2N3904EN8  41.27,24.77 0 top
2N3904P1  180.34,24.77 0 top
2N3904P2  161.93,24.77 0 top
2N3904P3  143.51,24.77 0 top
2N3904P4  123.83,24.77 0 top
2N3904P5  104.78,24.77 0 top
2N3904P6  86.36,24.77 0 top
2N3904P7  67.94,24.77 0 top
2N3904P8  48.9,24.77 0 top
9VCC  5.08,2.54 0 top
C_EN  13.97,44.45 0 top
C_P  13.97,40.64 0 top
COIL1  177.16,61.59 0 top
COIL2  46.35,61.59 0 top
COIL3  65.41,61.59 0 top
COIL4  83.82,61.59 0 top
COIL5  102.23,61.59 0 top
COIL6  121.28,61.59 0 top
COIL7  140.97,61.59 0 top
COIL8  159.38,61.59 0 top
COIL_AUX1  170.81,61.59 0 top
COIL_AUX2  40.01,61.59 0 top
COIL_AUX3  59.05,61.59 0 top
COIL_AUX4  77.47,61.59 0 top
COIL_AUX5  95.89,61.59 0 top
COIL_AUX6  114.94,61.59 0 top
COIL_AUX7  134.62,61.59 0 top
COIL_AUX8  153.03,61.59 0 top
CVCC1  15.24,7.62 0 top
CVCC2  15.24,32.38 0 top
D1  172.72,58.42 0 top
D2  153.67,58.42 0 top
D3  181.61,35.56 0 top
D4  185.42,28.57 90 top
D5  163.19,35.56 0 top
D6  167,28.57 90 top
D7  145.41,36.2 0 top
D8  148.59,28.57 90 top
D9  125.73,36.2 0 top
D10  128.91,28.57 90 top
D11  106.68,36.2 0 top
D12  109.86,28.57 90 top
D13  88.27,36.2 0 top
D14  91.44,28.57 90 top
D15  69.85,36.2 0 top
D16  73.03,28.57 90 top
D17  50.8,36.2 0 top
D18  53.98,28.57 90 top
D19  134.62,58.42 0 top
D20  114.94,59.05 0 top
D21  95.89,58.42 0 top
D22  76.83,59.05 0 top
D23  57.78,58.42 0 top
D24  38.73,58.42 0 top
EN1  171.45,6.99 0 top
EN2  40.01,6.99 0 top
EN3  59.05,6.99 0 top
EN4  77.47,6.99 0 top
EN5  95.89,6.99 0 top
EN6  114.94,6.99 0 top
EN7  134.62,6.99 0 top
EN8  153.03,6.99 0 top
EN_PINS  15.24,16.51 90 top
LED1  172.09,53.98 0 top
LED2  40.01,55.24 0 top
LED3  58.42,54.61 0 top
LED4  76.83,55.24 0 top
LED5  95.89,54.61 0 top
LED6  114.94,54.61 0 top
LED7  134.62,53.98 0 top
LED8  153.03,55.24 0 top
LINK_EN  25.4,31.75 0 top
LINK_P  25.4,59.69 0 top
P_PINS  6.99,40.64 90 top
PN2907EN1  172.72,32.38 0 top
PN2907EN2  154.31,32.38 0 top
PN2907EN3  135.89,32.38 0 top
PN2907EN4  116.2,32.38 0 top
PN2907EN5  97.16,32.38 0 top
PN2907EN6  78.74,32.38 0 top
PN2907EN7  60.33,32.38 0 top
PN2907EN8  40.01,32.38 0 top
PN2907P1  180.34,32.38 0 top
PN2907P2  161.93,32.38 0 top
PN2907P3  143.51,32.38 0 top
PN2907P4  123.83,32.38 0 top
PN2907P5  104.78,32.38 0 top
PN2907P6  86.36,32.38 0 top
PN2907P7  67.94,32.38 0 top
PN2907P8  48.9,32.38 0 top
PULSE1  175.26,6.99 0 top
PULSE2  43.81,6.99 0 top
PULSE3  62.87,6.99 0 top
PULSE4  81.28,6.99 0 top
PULSE5  99.69,6.99 0 top
PULSE6  118.75,6.99 0 top
PULSE7  138.43,6.99 0 top
PULSE8  156.84,6.99 0 top
Q1  172.09,42.55 0 top
Q2  153.67,42.55 0 top
Q4  134.62,42.55 0 top
Q5  115.57,43.18 0 top
Q6  96.52,42.55 0 top
Q7  77.47,43.18 0 top
Q8  59.69,43.18 0 top
Q9  40.01,42.55 0 top
R1  6.35,36.2 0 top
R2  2.54,42.55 90 top
R3  172.72,36.2 180 top
R4  154.31,36.2 0 top
R5  173.99,14.61 0 top
R6  173.99,18.41 0 top
R7  185.42,17.14 270 top
R8  181.61,17.14 90 top
R9  135.89,36.83 0 top
R10  116.2,36.83 0 top
R11  97.79,36.83 0 top
R12  40.64,37.46 0 top
R13  155.57,14.61 0 top
R14  155.57,18.41 0 top
R15  167,17.14 270 top
R16  163.19,17.14 90 top
R17  60.96,36.83 0 top
R18  137.16,14.61 0 top
R19  137.16,18.41 0 top
R20  148.59,17.14 270 top
R21  144.78,17.14 90 top
R22  79.38,36.83 0 top
R23  117.47,14.61 0 top
R24  117.47,18.41 0 top
R25  128.91,17.14 270 top
R26  125.09,17.14 90 top
R28  98.42,14.61 0 top
R29  98.42,18.41 0 top
R30  109.86,17.14 270 top
R31  106.05,17.14 90 top
R33  80.01,14.61 0 top
R34  80.01,18.41 0 top
R35  91.44,17.14 270 top
R36  87.63,17.14 90 top
R38  61.59,14.61 0 top
R39  61.59,18.41 0 top
R40  73.03,17.14 270 top
R41  69.22,17.14 90 top
R43  42.55,14.61 0 top
R44  42.55,18.41 0 top
R45  53.98,17.14 270 top
R46  50.16,17.14 90 top
SR_EN  25.4,17.78 90 top
SR_PULSE  25.4,45.72 90 top
U$1  [3,6]  15.88,55.88 0 top
VCC  5.08,22.86 0 top
VL  2.54,29.84 0 top
VR1  182.25,53.98 0 top
VR2  48.26,53.98 0 top
VR3  67.31,53.98 0 top
VR4  86.36,53.98 0 top
VR5  105.41,53.98 0 top
VR6  124.46,53.98 0 top
VR7  144.15,53.98 0 top
VR8  163.19,53.98 0 top
VR9  181.61,42.55 0 top
VR10  163.19,42.55 0 top
VR11  144.78,42.55 0 top
VR12  125.73,42.55 0 top
VR13  106.68,42.55 0 top
VR14  50.8,42.55 0 top
VR15  68.58,42.55 0 top
VR16  86.36,43.18 0 top

### Tracks (layer width: path | path; a pad name or v marks a point on that pad's centre or on a via)
EN1  (via drill 0.35)
  Top 0.152: 170.18,13.97 R5.P$1 170.18,8.25 EN1.1 166.37,1.91 26.67,1.91 v23.5,5.08
  Bottom 0.152: v23.5,5.08 23.5,10.8 22.86,11.43 SR_EN.15
EN2
  Top 0.152: R43.P$1 38.73,8.25 EN2.1 31.11,6.99 SR_EN.1
EN3
  Top 0.152: R38.P$1 57.78,8.25 EN3.1 57.78,5.71 29.84,5.71 27.94,7.62 27.94,10.8 28.57,11.43 SR_EN.2
EN4
  Top 0.152: R33.P$1 76.2,8.25 EN4.1 75.56,5.08 29.21,5.08 27.3,6.99 27.3,13.34 27.94,13.97 SR_EN.3
EN5
  Top 0.152: R28.P$1 94.61,8.25 EN5.1 95.89,5.71 94.61,4.45 27.94,4.45 26.67,5.71 26.67,14.61 28.57,16.51 SR_EN.4
EN6
  Top 0.152: R23.P$1 113.67,8.25 EN6.1 114.94,5.71 113.03,3.81 27.94,3.81 26.04,5.71 26.04,17.14 27.94,19.05 SR_EN.5
EN7
  Top 0.152: R18.P$1 133.35,8.25 EN7.1 130.81,3.17 27.3,3.17 25.4,5.08 25.4,18.41 28.57,21.59 SR_EN.6
EN8
  Top 0.152: R13.P$1 151.76,8.25 EN8.1 153.03,3.17 152.4,2.54 26.67,2.54 24.77,4.45 24.77,20.95 27.94,24.13 SR_EN.7
GND
  Top 0.152: R6.P$1 170.18,23.49 2N3904EN1.3 | R8.P$1 179.07,15.88 2N3904P1.3 | CVCC1.- 10.12,10.24 9VCC.GND 6.78,10.24 9VCC.GNDBREAK | VCC.6 12.74,29.25 CVCC2.- 12.74,33.7 15.88,36.83 15.88,40.13 C_P.2 | 2N3904EN2.3 151.76,23.49 R14.P$1 149.86,18.41 R21.P$1 142.24,15.88 2N3904P3.3 | R16.P$1 160.66,15.88 2N3904P2.3 | 2N3904EN3.3 133.35,23.49 R19.P$1 130.81,18.41 127,14.61 126.36,14.61 R26.P$1 122.56,15.88 2N3904P4.3 | COIL7.2 COIL_AUX8.1 D2.A 149.86,50.16 2N8.E | R24.P$1 113.67,23.49 2N3904EN4.3 | R29.P$1 94.61,23.49 2N3904EN5.3 93.34,27.3 93.34,48.26 2N5.E | R31.P$1 103.5,15.88 2N3904P5.3 | R34.P$1 76.2,23.49 2N3904EN6.3 74.93,27.3 2N4.E | R36.P$1 85.09,15.88 2N3904P6.3 | COIL5.2 COIL_AUX6.1 | 2N3904EN7.3 57.78,23.49 R39.P$1 55.24,18.41 R46.P$1 47.62,15.88 2N3904P8.3 | R41.P$1 66.67,15.88 2N3904P7.3 | R44.P$1 38.73,23.49 2N3904EN8.3 31.11,24.77 SR_EN.8 | 2N1.E 168.91,49.53 D1.A | D19.A 132.08,57.15 2N7.E | D19.A 133.99,61.59 COIL_AUX7.1 | D19.A 127.64,61.59 COIL6.2 | 2N6.E 111.12,50.8 D20.A | 2N3.E 55.24,57.15 D23.A
  Bottom 0.152: 2N3904P1.3 175.26,28.57 172.72,28.57 171.45,27.3 2N3904EN1.3 170.18,26.04 170.18,28.57 171.45,29.84 171.45,33.02 169.54,34.92 2N1.E | 9VCC.GNDBREAK 9.78,29.46 12.7,32.38 | 12.7,32.38 CVCC2.- | VCC.6 VCC.4 VCC.2 1.27,25.4 1.27,31.75 1.91,32.38 VL.2 VL.4 VL.6 | C_P.2 C_EN.2 19.18,48.26 22.86,48.26 26.67,52.07 26.67,53.34 27.94,54.61 SR_PULSE.8 | SR_EN.8 25.4,26.67 23.5,28.57 15.88,28.57 12.7,31.75 12.7,32.38 | 2N3904P2.3 156.84,28.57 153.67,28.57 153.03,27.94 2N3904EN2.3 | R6.P$1 167,15.24 165.1,15.24 R16.P$1 | COIL8.2 COIL_AUX1.1 170.81,60.32 D1.A | 142.24,23.49 2N3904P3.3 140.97,24.77 137.79,27.94 135.25,27.94 134.62,27.3 2N3904EN3.3 | 122.56,23.49 2N3904P4.3 118.75,28.57 116.2,28.57 114.94,27.3 2N3904EN4.3 | COIL_AUX6.1 113.67,60.32 112.39,60.32 D20.A | 103.5,23.49 2N3904P5.3 100.33,27.94 96.52,27.94 95.89,27.3 2N3904EN5.3 | COIL_AUX5.1 94.61,60.32 93.98,60.32 D21.A 89.53,58.42 COIL4.2 | 85.09,23.49 2N3904P6.3 81.92,27.94 78.11,27.94 77.47,27.3 2N3904EN6.3 | 66.67,23.49 2N3904P7.3 63.5,27.94 59.69,27.94 59.05,27.3 2N3904EN7.3 | 47.62,23.49 2N3904P8.3 44.45,27.94 40.64,27.94 40.01,27.3 2N3904EN8.3 | R31.P$1 111.12,18.41 R24.P$1 | R36.P$1 92.71,18.41 R29.P$1 | R41.P$1 74.3,18.41 R34.P$1 | COIL3.2 COIL_AUX4.1 75.56,61.59 D22.A | COIL_AUX3.1 57.15,61.59 D23.A 52.07,58.42 49.21,61.28 | 49.21,61.28 COIL2.2 | SR_PULSE.8 31.11,54.61 D24.A 36.83,60.32 38.73,60.32 COIL_AUX2.1 40.01,60.32 40.64,59.69 47.62,59.69 49.21,61.28 | SR_PULSE.8 33.66,54.61 37.47,50.8 2N2.E
  pour Top: 2.54,0 0,2.54 0,46.99 17.14,64.14 181.61,64.14 187.96,57.78 187.96,12.07 175.9,0
  pour Bottom: 0,1.91 0,46.99 15.24,62.23 183.51,62.23 187.96,57.78 187.96,12.07 175.9,0 1.91,0
LINK_EN
  Top 0.152: SR_EN.9 21.59,27.94 LINK_EN.1
LINK_P
  Bottom 0.152: SR_PULSE.9 21.59,55.88 LINK_P.1
N$1
  Top 0.152: PN2907EN2.B 155.57,29.84 2N3904EN2.1
N$2
  Top 0.152: PN2907EN3.B 137.16,29.84 2N3904EN3.1
N$3
  Top 0.152: PN2907EN1.B 173.99,29.84 2N3904EN1.1
N$4
  Top 0.152: PN2907EN4.B 117.47,29.84 2N3904EN4.1
N$5
  Top 0.152: PN2907EN5.B 98.42,29.84 2N3904EN5.1
N$6
  Top 0.152: PN2907EN8.B 42.55,28.57 2N3904EN8.1
N$7
  Top 0.152: VR9.3 181.65,45.03 | 181.65,45.03 VR9.2 | 2N1.B 177.15,53.96 VR1.1 181.65,52.02 181.65,45.03
N$8
  Top 0.152: PN2907EN7.B 61.59,29.84 2N3904EN7.1
N$9
  Top 0.152: VR9.1 179.07,41.91 D3.C
N$10
  Top 0.152: Q1.B 172.09,46.35 2N1.C
N$11
  Top 0.152: PN2907P1.C 184.15,29.84 184.15,26.04 D4.A
N$12
  Top 0.152: R3.P$1 177.16,36.2 D3.A
  Bottom 0.152: PN2907EN1.C 175.26,33.02 D3.A
N$13
  Top 0.152: 2N3904P1.2 180.34,22.22 R8.P$2 R7.P$1
N$14
  Top 0.152: PN2907P1.B 181.61,29.84 2N3904P1.1
N$15
  Top 0.152: R5.P$2 R6.P$2 176.53,18.41 172.72,22.22 2N3904EN1.2
N$16
  Top 0.152: VR10.3 163.24,45.03 VR10.2 163.19,51.42 VR8.1 158.74,53.96 2N8.B
N$17
  Top 0.152: PN2907EN6.B 80.01,29.84 2N3904EN6.1
N$18
  Top 0.152: D5.C 167,36.18 VR10.1
N$19
  Top 0.152: Q2.B 153.67,46.35 2N8.C
N$20
  Top 0.152: PN2907P2.C 165.74,29.84 165.74,26.04 D6.A
N$21
  Top 0.152: R4.P$1 154.94,34.29 156.84,34.29 158.12,35.56 D5.A
  Bottom 0.152: PN2907EN2.C 156.84,33.02 D5.A
N$22
  Top 0.152: 2N3904P2.2 161.93,22.22 R16.P$2 R15.P$1
N$23
  Top 0.152: PN2907P2.B 163.19,29.84 2N3904P2.1
N$24
  Top 0.152: R13.P$2 R14.P$2 158.12,18.41 154.31,22.22 2N3904EN2.2
N$25
  Top 0.152: D9.C 129.53,36.2 VR12.1
N$26
  Top 0.152: VR11.1 148.57,36.2 D7.C
N$27
  Top 0.152: Q4.B 134.62,46.35 2N7.C
N$28
  Top 0.152: PN2907P3.C 147.32,29.84 147.32,26.04 D8.A
N$29
  Top 0.152: R9.P$1 137.16,34.29 139.06,34.29 140.97,36.2 D7.A
  Bottom 0.152: PN2907EN3.C 138.43,33.02 D7.A
N$30
  Top 0.152: 2N3904P3.2 143.51,22.22 R21.P$2 R20.P$1
N$31
  Top 0.152: PN2907P3.B 144.78,29.84 2N3904P3.1
N$32
  Top 0.152: R18.P$2 R19.P$2 139.7,18.41 135.89,22.22 2N3904EN3.2
N$33
  Top 0.152: VR12.3 125.77,45.03 VR12.2 125.73,50.15 VR6.1 119.36,53.96 115.57,50.16 2N6.B
N$34
  Top 0.152: R3.P$2 170.81,36.83 Q1.E
N$35
  Top 0.152: Q5.B 118.11,47.62 2N6.C
N$36
  Top 0.152: PN2907P4.C 127.64,29.84 127.64,26.04 D10.A
N$37
  Top 0.152: R10.P$1 116.2,35.56 121.28,35.56 D9.A
  Bottom 0.152: PN2907EN4.C 118.75,33.02 D9.A
N$38
  Top 0.152: 2N3904P4.2 123.83,22.22 R26.P$2 R25.P$1
N$39
  Top 0.152: PN2907P4.B 125.09,29.84 2N3904P4.1
N$40
  Top 0.152: R23.P$2 R24.P$2 120.02,18.41 116.2,22.22 2N3904EN4.2
N$41
  Top 0.152: VR13.3 106.72,45.03 | 106.72,45.03 VR13.2 | 2N5.B 101.58,53.96 VR5.1 106.72,50.11 106.72,45.03
N$42
  Top 0.152: D11.C 110.47,36.2 VR13.1
N$43
  Top 0.152: 2N5.C 99.06,46.99 Q6.B
N$44
  Top 0.152: PN2907P5.C 108.58,29.84 108.58,26.04 D12.A
N$45
  Top 0.152: R11.P$1 98.42,34.92 101.6,34.92 D11.A
  Bottom 0.152: PN2907EN5.C 99.69,33.02 D11.A
N$46
  Top 0.152: 2N3904P5.2 104.78,22.22 R31.P$2 R30.P$1
N$47
  Top 0.152: PN2907P5.B 106.05,29.84 2N3904P5.1
N$48
  Top 0.152: R28.P$2 R29.P$2 100.97,18.41 97.16,22.22 2N3904EN5.2
N$49
  Top 0.152: R4.P$2 152.4,39.37 Q2.E
N$50
  Top 0.152: D13.C 85.11,43.16 VR16.1
N$51
  Top 0.152: Q7.B 80.01,47.62 2N4.C
N$52
  Top 0.152: PN2907P6.C 90.17,29.84 90.17,26.04 D14.A
N$53
  Top 0.152: R22.P$1 80.01,34.92 83.19,34.92 D13.A
  Bottom 0.152: PN2907EN6.C 81.28,33.02 D13.A
N$54
  Top 0.152: 2N3904P6.2 86.36,22.22 R36.P$2 R35.P$1
N$55
  Top 0.152: PN2907P6.B 87.63,29.84 2N3904P6.1
N$56
  Top 0.152: R33.P$2 R34.P$2 82.55,18.41 78.74,22.22 2N3904EN6.2
N$57
  Top 0.152: R9.P$2 133.35,40.64 Q4.E
N$58
  Top 0.152: D15.C 67.33,42.53 VR15.1
N$59
  Top 0.152: Q8.B 60.33,45.72 2N3.C
N$60
  Top 0.152: PN2907P7.C 71.75,29.84 71.75,26.04 D16.A
N$61
  Top 0.152: R17.P$1 61.59,34.92 62.87,34.92 64.14,36.2 D15.A
  Bottom 0.152: PN2907EN7.C 62.87,33.02 D15.A
N$62
  Top 0.152: 2N3904P7.2 67.94,22.22 R41.P$2 R40.P$1
N$63
  Top 0.152: PN2907P7.B 69.22,29.84 2N3904P7.1
N$64
  Top 0.152: R38.P$2 R39.P$2 64.14,18.41 60.33,22.22 2N3904EN7.2
N$65
  Top 0.152: R10.P$2 114.3,40.01 Q5.E
N$66
  Top 0.152: D17.C 48.27,42.53 VR14.1
N$67
  Top 0.152: Q9.B 40.01,45.72 2N2.C
N$68
  Top 0.152: PN2907P8.C 52.7,29.84 52.7,26.04 D18.A
N$69
  Top 0.152: R12.P$1 40.64,36.2 D17.A
  Bottom 0.152: PN2907EN8.C 42.55,31.75 D17.A
N$70
  Top 0.152: 2N3904P8.2 48.9,22.22 R46.P$2 R45.P$1
N$71
  Top 0.152: PN2907P8.B 50.16,29.84 2N3904P8.1
N$72
  Top 0.152: R43.P$2 R44.P$2 45.09,18.41 41.27,22.22 2N3904EN8.2
N$73
  Top 0.152: VR15.3 68.62,45.03 VR15.2 67.28,46.33 67.28,51.45 VR3.1 | 64.12,53.96 VR3.1 | 2N3.B 62.22,53.96 VR3.1
N$74
  Top 0.152: VR11.3 144.82,45.03 VR11.2 144.78,50.78 VR7.1 139.69,53.96 2N7.B
N$75
  Top 0.152: VR14.3 50.84,45.03 VR14.2 45.72,50.11 VR2.1 45.7,53.96 2N2.B
N$76
  Top 0.152: VR16.3 86.4,45.66 VR16.2 83.82,48.2 VR4.1 | 83.81,53.96 VR4.1 | 2N4.B 81.9,53.96 VR4.1
N$77
  Top 0.152: R11.P$2 95.25,40.64 Q6.E
N$78
  Top 0.152: R12.P$2 38.73,40.64 Q9.E
N$79
  Top 0.152: R17.P$2 58.42,40.64 Q8.E
N$80
  Top 0.152: R22.P$2 76.2,41.27 Q7.E
N$81
  Bottom 0.152: D1.C 175.26,58.42 LED1.A
N$82
  Bottom 0.152: LED8.A 154.94,58.42 D2.C
N$83
  Bottom 0.152: LED7.A 137.79,58.42 D19.C
N$84
  Bottom 0.152: LED6.A 118.11,59.05 D20.C
N$85
  Bottom 0.152: LED5.A 98.42,58.42 D21.C
N$86
  Bottom 0.152: LED2.A 41.91,58.42 D24.C
N$87
  Bottom 0.152: LED3.A 60.96,58.42 D23.C
N$88
  Bottom 0.152: LED4.A 79.38,59.05 D22.C
OEBAR_EN
  Top 0.152: SR_EN.13 EN_PINS.1 9.53,16.51 6.35,19.68 6.35,26.04 10.16,29.84 R1.P$2
OEBAR_P
  Top 0.152: 6.35,41.27 P_PINS.1 | P_PINS.1 8.89,42.55 20.32,42.55 21.59,43.81 SR_PULSE.13 | P_PINS.1 2.54,45.09 R2.P$2
PULSE1
  Top 0.152: SR_PULSE.15 22.86,39.37 24.13,38.1 24.13,35.56 25.4,34.29 26.04,34.29 27.94,32.38 27.94,31.11 24.13,27.3 24.13,9.53 22.23,7.62 22.23,5.08 26.04,1.27 169.54,1.27 PULSE1.1 176.53,8.25 180.34,8.25 R7.P$2
PULSE2
  Top 0.152: PULSE2.1 46.99,10.16 50.8,10.16 R45.P$2
  Bottom 0.152: PULSE2.1 43.81,5.71 43.18,5.08 34.92,5.08 30.48,9.53 30.48,35.56 SR_PULSE.1
PULSE3
  Top 0.152: PULSE3.1 64.14,8.25 67.94,8.25 R40.P$2
  Bottom 0.152: PULSE3.1 62.23,6.99 60.96,8.25 32.38,8.25 31.11,9.53 31.11,38.1 29.84,39.37 SR_PULSE.2
PULSE4
  Top 0.152: PULSE4.1 82.55,8.25 86.36,8.25 R35.P$2
  Bottom 0.152: PULSE4.1 80.01,6.99 78.11,8.89 33.02,8.89 31.75,10.16 31.75,40.01 29.84,41.91 SR_PULSE.3
PULSE5
  Top 0.152: PULSE5.1 100.97,8.25 107.31,8.25 109.86,10.8 R30.P$2
  Bottom 0.152: PULSE5.1 97.16,9.53 33.66,9.53 32.38,10.8 32.38,43.18 31.11,44.45 SR_PULSE.4
PULSE6
  Top 0.152: PULSE6.1 120.02,8.25 126.36,8.25 128.91,10.8 R25.P$2
  Bottom 0.152: PULSE6.1 115.57,10.16 34.29,10.16 33.02,11.43 33.02,46.35 32.38,46.99 SR_PULSE.5
PULSE7
  Top 0.152: PULSE7.1 139.7,8.25 146.05,8.25 148.59,10.8 R20.P$2
  Bottom 0.152: 138.43,6.35 PULSE7.1 134.62,10.8 34.29,10.8 33.66,11.43 33.66,48.89 33.02,49.53 SR_PULSE.6
PULSE8
  Top 0.152: PULSE8.1 158.12,8.25 164.47,8.25 167,10.8 R15.P$2
  Bottom 0.152: 156.21,6.99 PULSE8.1 152.4,11.43 34.92,11.43 34.29,12.07 34.29,50.8 33.02,52.07 SR_PULSE.7
RCLK_EN
  Top 0.152: EN_PINS.2 SR_EN.12
RCLK_P
  Top 0.152: P_PINS.2 10.79,46.99 SR_PULSE.12
S2
  Top 0.152: Q1.C 180.97,34.92 182.88,34.92 D4.C | VR1.3 182.28,56.46 VR1.2 177.16,61.54 COIL1.1 | LED1.K COIL_AUX1.2
  Bottom 0.152: Q1.C LED1.K | COIL1.1 COIL_AUX1.2
S3
  Top 0.152: Q2.C 162.56,34.92 164.47,34.92 D6.C | VR8.3 163.24,56.46 VR8.2 159.38,60.27 COIL8.1 | LED8.K 154.31,60.32 COIL_AUX8.2
  Bottom 0.152: Q2.C 154.94,54.61 LED8.K | COIL_AUX8.2 COIL8.1
S4
  Top 0.152: Q4.C 137.79,42.55 145.41,34.92 146.05,34.92 D8.C | VR7.3 144.19,56.46 VR7.2 140.97,59.63 COIL7.1 | LED7.K 135.89,60.32 COIL_AUX7.2
  Bottom 0.152: Q4.C LED7.K | COIL_AUX7.2 COIL7.1
S5
  Top 0.152: Q5.C 125.09,34.92 126.36,34.92 D10.C | VR6.3 124.5,56.46 VR6.2 121.28,59.63 COIL6.1 | LED6.K 116.2,60.32 COIL_AUX6.2
  Bottom 0.152: Q5.C 116.84,53.98 LED6.K | COIL_AUX6.2 COIL6.1
S6
  Top 0.152: Q6.C 99.06,42.55 106.68,34.92 107.31,34.92 D12.C | VR5.3 105.45,56.46 VR5.2 102.23,59.63 COIL5.1 | LED5.K 97.16,60.32 COIL_AUX5.2
  Bottom 0.152: Q6.C 97.79,53.98 LED5.K | COIL_AUX5.2 COIL5.1
S7
  Top 0.152: Q7.C 79.38,43.18 87.63,34.92 88.9,34.92 D14.C | VR4.3 86.4,56.46 VR4.2 83.82,59 COIL4.1 | LED4.K 78.11,59.69 COIL_AUX4.2
  Bottom 0.152: Q7.C 78.74,53.98 78.11,54.61 LED4.K | COIL_AUX4.2 COIL4.1
S8
  Top 0.152: Q8.C 69.22,34.92 70.48,34.92 D16.C | VR3.3 67.35,56.46 VR3.2 65.41,58.37 COIL3.1 | LED3.K 59.69,59.69 COIL_AUX3.2
  Bottom 0.152: COIL_AUX3.2 COIL3.1 | LED3.K 61.59,52.7 61.59,43.81 Q8.C
S9
  Top 0.152: Q9.C 43.18,42.55 50.16,35.56 50.8,35.56 D18.C | VR2.3 48.3,56.46 VR2.2 46.35,58.37 COIL2.1 | LED2.K 41.27,60.32 COIL_AUX2.2
  Bottom 0.152: Q9.C LED2.K | COIL_AUX2.2 COIL2.1
SCK_EN
  Top 0.152: EN_PINS.3 SR_EN.11
SCK_P
  Top 0.152: SR_PULSE.11 19.05,49.53 18.41,49.53 10.79,49.53 P_PINS.3
SER_EN
  Top 0.152: EN_PINS.4 16.51,22.86 22.23,22.86 23.5,21.59 23.5,15.88 SR_EN.14
SER_P
  Top 0.152: P_PINS.4 9.53,50.8 22.23,50.8 24.13,48.89 24.13,42.55 23.5,41.91 SR_PULSE.14
VCC  (via drill 0.35)
  Top 0.152: PN2907P1.E 177.8,32.38 176.53,33.66 172.72,33.66 PN2907EN1.E | CVCC1.+ 15.84,5.71 4.45,5.71 1.91,8.25 1.91,13.34 4.81,16.24 9VCC.PWR | VCC.5 7.62,22.27 CVCC2.+ | PN2907P2.E 159.38,32.38 158.12,33.66 154.31,33.66 PN2907EN2.E 150.5,29.84 148.59,29.84 147.32,31.11 147.32,32.38 146.05,33.66 142.88,33.66 140.97,31.75 PN2907P3.E 140.97,32.38 139.7,33.66 135.25,33.66 133.35,31.75 PN2907EN3.E 132.72,30.48 128.91,30.48 127.64,31.75 127.64,32.38 126.36,33.66 122.56,33.66 121.28,32.38 | 121.28,32.38 120.02,33.66 116.2,33.66 PN2907EN4.E 112.39,29.84 109.86,29.84 108.58,31.11 108.58,32.38 107.31,33.66 104.78,33.66 PN2907P5.E 102.23,32.38 100.97,33.66 97.16,33.66 PN2907EN5.E | 121.28,32.38 PN2907P4.E | PN2907P6.E 83.82,32.38 82.55,33.66 78.74,33.66 PN2907EN6.E | PN2907P7.E 65.41,32.38 64.14,33.66 60.33,33.66 PN2907EN7.E | PN2907P8.E 46.35,32.38 45.09,33.66 40.01,33.66 PN2907EN8.E v29.21,31.11
  Bottom 0.152: VCC.3 9VCC.PWR | PN2907EN1.E 167,27.94 162.56,27.94 PN2907P2.E | PN2907EN5.E 92.71,31.11 90.81,29.21 85.09,29.21 83.82,30.48 PN2907P6.E | PN2907EN6.E 74.3,29.21 66.67,29.21 65.41,30.48 PN2907P7.E | v29.21,31.11 27.94,29.84 20.28,29.84 CVCC2.+ | VCC.5 VCC.3 | VCC.3 VCC.1 | PN2907EN7.E 56.52,31.11 53.98,28.57 48.9,28.57 PN2907P8.E
VL
  Top 0.152: SR_EN.10 19.68,26.04 19.68,34.92 SR_PULSE.16
  Bottom 0.152: SR_EN.16 19.68,10.8 19.68,22.22 SR_EN.10 | VL.1 VL.3 VL.5 12.57,34.8 C_P.1 | C_P.1 C_EN.1 20.19,52.07 SR_PULSE.10 | C_P.1 14.48,38.73 19.68,38.73 SR_PULSE.16

### Text on the board
tPlace: 2 | 3 | 4 | 5 | 6 | 7 | 8 | 1 | pendulum kicker / [enable, trigger, oscillate] / Nolan Lem 2021